# Altium schematic sheet io-headers.SchDoc
size A
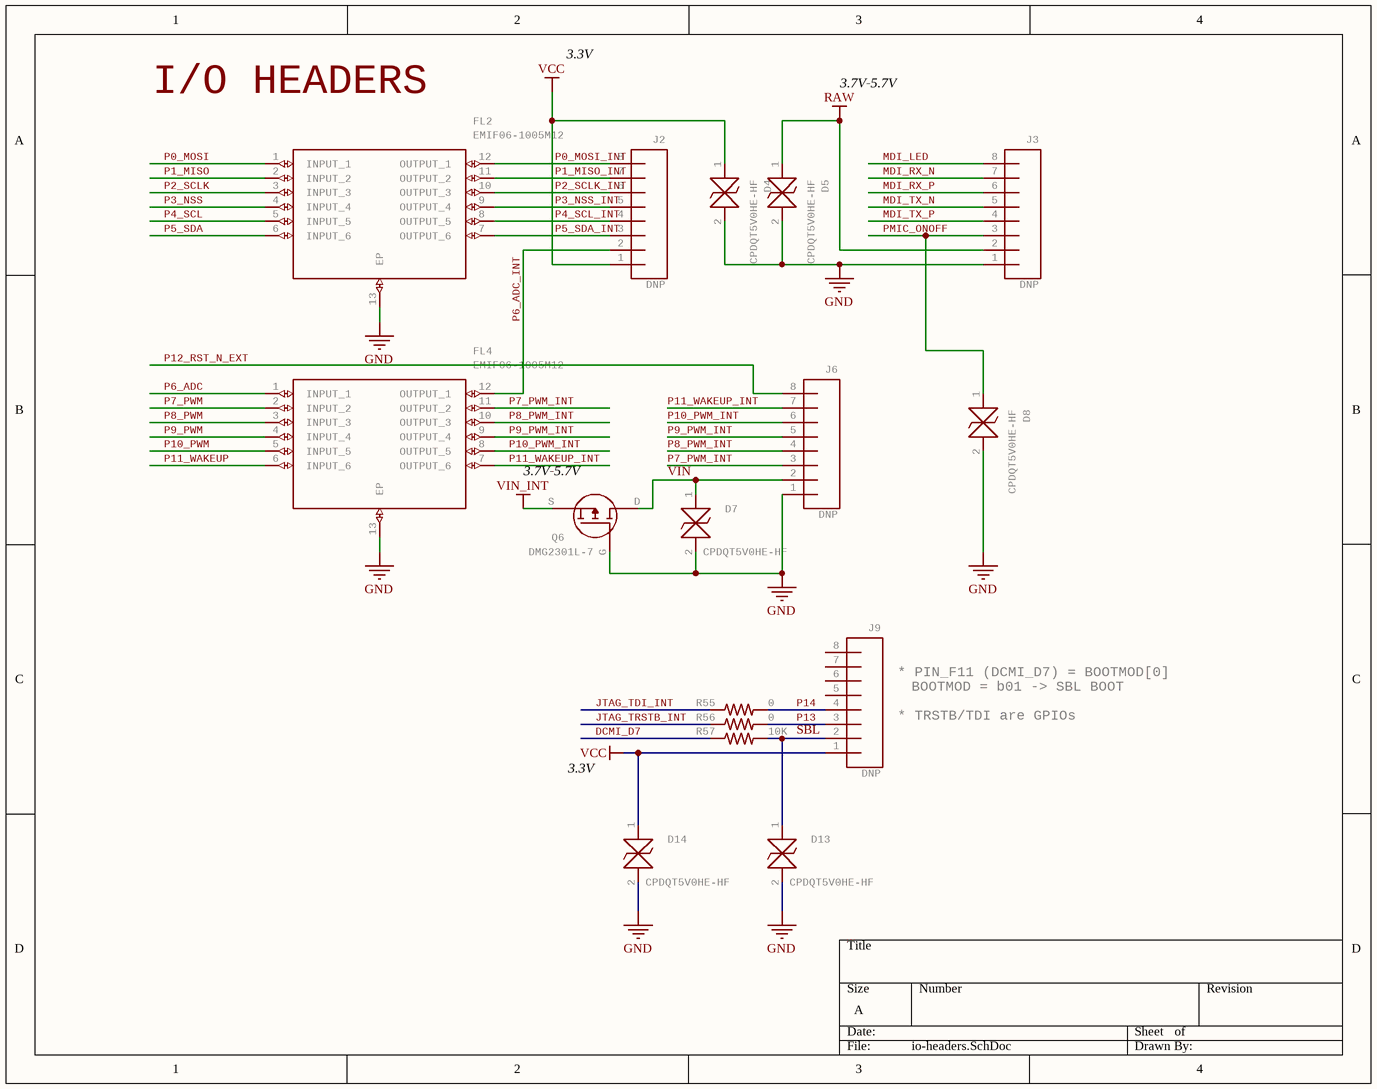
[diagram p0: io-headers.SchDoc]

## Parts
D4  CPDQT5V0HE-HF  [CPDQT5V0HEHF]
D5  CPDQT5V0HE-HF  [CPDQT5V0HEHF]
D7  CPDQT5V0HE-HF  [CPDQT5V0HEHF]
D8  CPDQT5V0HE-HF  [CPDQT5V0HEHF]
D13  CPDQT5V0HE-HF  [CPDQT5V0HEHF]
D14  CPDQT5V0HE-HF  [CPDQT5V0HEHF]
FL2  EMIF06-1005M12  [SON40P150X250X65-13N]
FL4  EMIF06-1005M12  [SON40P150X250X65-13N]
J2  DNP  [1X08]
J3  DNP  [1X08]
J6  DNP  [1X08]
J9  DNP  [1X08]
Q6  DMG2301L-7  [SOT-23-3-FET]
R55  0  [0402-RES]
R56  0  [0402-RES]
R57  10K  [0402-RES]

## Nets
GND: D4.2 D5.2 D7.2 D8.2 D13.2 D14.2 FL2.13(EP) FL4.13(EP) J3.1 J6.1 Q6.G
RAW: D5.1 J3.2
VCC: D4.1 D14.1 J2.1 J9.1
VIN_INT: Q6.S
DCMI_D7: R57.1
JTAG_TDI_INT: R55.1
JTAG_TRSTB_INT: R56.1
MDI_LED: J3.8
MDI_RX_N: J3.7
MDI_RX_P: J3.6
MDI_TX_N: J3.5
MDI_TX_P: J3.4
P0_MOSI: FL2.1(INPUT_1)
P0_MOSI_INT: FL2.12(OUTPUT_1) J2.8
P1_MISO: FL2.2(INPUT_2)
P1_MISO_INT: FL2.11(OUTPUT_2) J2.7
P2_SCLK: FL2.3(INPUT_3)
P2_SCLK_INT: FL2.10(OUTPUT_3) J2.6
P3_NSS: FL2.4(INPUT_4)
P3_NSS_INT: FL2.9(OUTPUT_4) J2.5
P4_SCL: FL2.5(INPUT_5)
P4_SCL_INT: FL2.8(OUTPUT_5) J2.4
P5_SDA: FL2.6(INPUT_6)
P5_SDA_INT: FL2.7(OUTPUT_6) J2.3
P6_ADC: FL4.1(INPUT_1)
P6_ADC_INT: FL4.12(OUTPUT_1) J2.2
P7_PWM: FL4.2(INPUT_2)
P7_PWM_INT: FL4.11(OUTPUT_2) J6.3
P8_PWM: FL4.3(INPUT_3)
P8_PWM_INT: FL4.10(OUTPUT_3) J6.4
P9_PWM: FL4.4(INPUT_4)
P9_PWM_INT: FL4.9(OUTPUT_4) J6.5
P10_PWM: FL4.5(INPUT_5)
P10_PWM_INT: FL4.8(OUTPUT_5) J6.6
P11_WAKEUP: FL4.6(INPUT_6)
P11_WAKEUP_INT: FL4.7(OUTPUT_6) J6.7
P12_RST_N_EXT: J6.8
P13: J9.3 R56.2
P14: J9.4 R55.2
PMIC_ONOFF: D8.1 J3.3
SBL: D13.1 J9.2 R57.2
VIN: D7.1 J6.2 Q6.D

Not connected (* = marked no-connect by the designer): J9 5 6 7 8

## Notes on the sheet
- I/O HEADERS
- 3.3V
- 3.7V-5.7V
- (near Q6) 3.7V-5.7V
- (near J9) * PIN_F11 (DCMI_D7) = BOOTMOD[0]
- (near J9) * TRSTB/TDI are GPIOs
- BOOTMOD = b01 -> SBL BOOT

## Library data of the parts
D4 D5 D7 D8 D13 D14 = CPDQT5V0HE-HF: ESD Suppressors / TVS Diodes DIODE ESD 5VWM 65W 0402/SOD-923F   Source:  Datasheet; MANUFACTURER_NAME: Comchip Technology; GateName_1: G$1; SymbolName_1: CPDQT5V0HE-HF; LibraryName: CPDQT5V0HE-HF; DeviceSetName: CPDQT5V0HE-HF; HEIGHT: 0.42mm; MANUFACTURER_PART_NUMBER: CPDQT5V0HE-HF; MOUSER_PART_NUMBER: MOUSER_PART_NUMBER; MOUSER_PRICE-STOCK: MOUSER_PRICE-STOCK; MPN: CPDQT5V0HE-HF; Part Number: CPDQT5V0HE-HF
FL2 FL4 = EMIF06-1005M12: EMI Filter Circuits 6lin lw cpcitnc EMI 45pF -35db @ 900MHz   Source:  Datasheet; MANUFACTURER_NAME: STMicroelectronics; GateName_1: G$1; SymbolName_1: EMIF06-1005M12; LibraryName: EMIF06-1005M12; DeviceSetName: EMIF06-1005M12; HEIGHT: 0.65mm; MANUFACTURER_PART_NUMBER: EMIF06-1005M12; MOUSER_PART_NUMBER: 511-EMIF06-1005M12; MOUSER_PRICE-STOCK: https://www.mouser.co.uk/ProductDetail/STMicroelectronics/EMIF06-1005M12?qs=VJaATVMq%252BXo0u09ZqtQg3A%3D%3D; MPN: EMIF06-1005M12; Part Number: EMIF06-1005M12
J2 J3 J6 J9 = CONN_08": Multi connection point. Often used as Generic Header-pin footprint for 0.1 inch spaced/style header connections    On any of the 0.1 inch spaced packages, you can populate with these:  Break Away Headers - Straight (PRT-00116)   Break Away Male Headers - Right Angle (PRT-00553)   Female Headers (PRT-00115)   Break Away Headers - Machine Pin (PRT-00117)   Break Away Female Headers - Swiss Machine Pin (PRT-00743)   Arduino Stackable Header - 8 Pin (PRT-09279)        For SCREWTERMINALS and SPRING TERMINALS visit here:  Screw Terimnals on SparkFun.com (5mm/3.5mm/2.54mm spacing)       This device is also useful as a general connection point to wire up your design to another part of your project. Our various solder wires solder well into these plated through hole pads.  Hook-Up Wire - Assortment (Stranded, 22 AWG) (PRT-11375)   Hook-Up Wire - Assortment (Solid Core, 22 AWG) (PRT-11367)   View the entire wire category on our website here          Special notes:     Molex polarized connector foot print use with SKU : PRT-08231 with associated crimp pins and housings. 1MM SMD Version SKU: PRT-10208    NOTES ON THE VARIANTS LOCK and LOCK_LONGPADS... This footprint was designed to help hold the alignment of a through-hole component (i.e.  6-pin header) while soldering it into place. You may notice that each hole has been shifted either up or down by 0.005 of an inch from it's more standard position (which is a perfectly straight line).  This slight alteration caused the pins (the squares in the middle) to touch the edges of the holes.  Because they are alternating, it causes a "brace" to hold the component in place.  0.005 has proven to be the perfect amount of "off-center" position when using our standard breakaway headers. Although looks a little odd when you look at the bare footprint, once you have a header in there, the alteration is very hard to notice.  Also,if you push a header all the way into place, it is covered up entirely on the bottom side.; GateName_1: G$1; DeviceName: "; POPULATE: 0; PROD_ID: CONN-08438; SymbolName_1: CONN_08; LibraryName: SparkFun-Connectors; DeviceSetName: CONN_08; MPN: DNP; Part Number: DNP
Q6 = DMG2301L-7: GateName_1: G$1; HEIGHT: 1.1mm; MPN: DMG2301L-7; Part Number: DMG2301L-7
R55 R56 = RESISTOR0402-RES: ResistorBasic schematic elements and footprints for 0603, 1206, and PTH resistors.; MPN: RC0402JR-070R; GateName_1: G$1; SymbolName_1: RESISTOR; DeviceName: 0402-RES; LibraryName: sfe; DeviceSetName: RESISTOR; Part Number: RC0402JR-070R
R57 = RESISTOR0402-RES: ResistorBasic schematic elements and footprints for 0603, 1206, and PTH resistors.; MPN: AC0402FR-1310K; GateName_1: G$1; SymbolName_1: RESISTOR; DeviceName: 0402-RES; LibraryName: sfe; DeviceSetName: RESISTOR; Part Number: AC0402FR-1310K